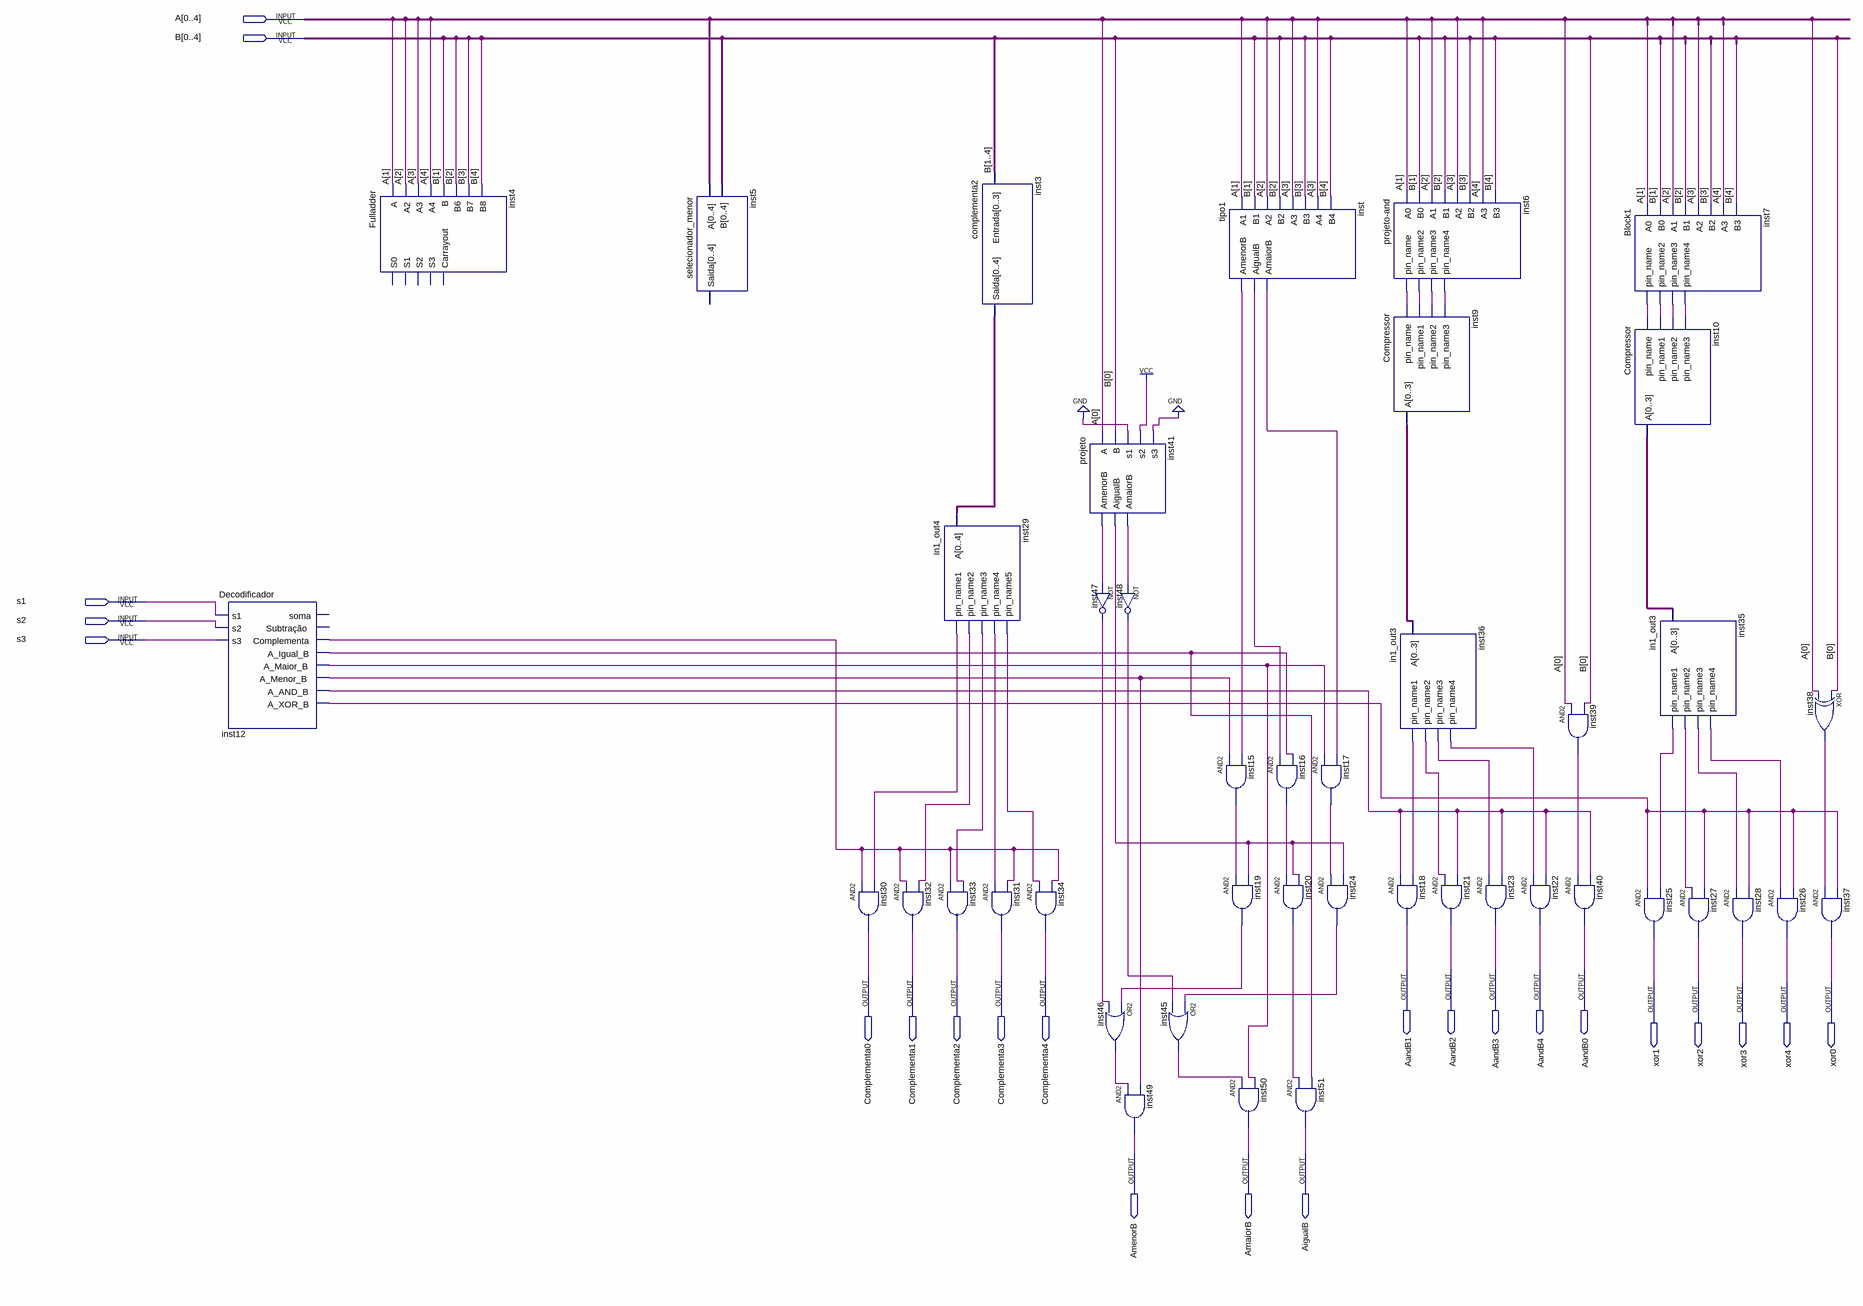
[diagram p0: schematic sheet]
// Quartus schematic Projeto_Total.bdf as structural Verilog: 43 symbols, 23 pins
module Projeto_Total (
  input  [0:4] A,
  input  [0:4] B,
  input  s1,
  input  s2,
  input  s3,
  output AandB1,
  output AandB2,
  output AandB3,
  output AandB4,
  output AandB0,
  output Complementa0,
  output Complementa1,
  output Complementa2,
  output Complementa3,
  output Complementa4,
  output xor1,
  output xor2,
  output xor3,
  output xor4,
  output xor0,
  output AmenorB,
  output AmaiorB,
  output AigualB
);

  wire inst6_pin_name, inst6_pin_name2, inst6_pin_name3, inst6_pin_name4, inst7_pin_name, inst7_pin_name2,
       inst7_pin_name3, inst7_pin_name4, inst12_a_and_b, inst12_a_igual_b, inst12_a_maior_b,
       inst12_a_menor_b, inst12_a_xor_b, inst12_complementa, inst15_out, inst16_out, inst17_out, inst19_out,
       inst20_out, inst24_out, inst29_pin_name1, inst29_pin_name2, inst29_pin_name3, inst29_pin_name4,
       inst29_pin_name5, inst35_pin_name1, inst35_pin_name2, inst35_pin_name3, inst35_pin_name4,
       inst36_pin_name1, inst36_pin_name2, inst36_pin_name3, inst36_pin_name4, inst38_out, inst39_out,
       inst41_aigualb, inst41_amaiorb, inst41_amenorb, inst45_out, inst46_out, inst47_out, inst48_out,
       inst_aigualb, inst_amaiorb, inst_amenorb;
  wire [3:0] inst9_a, inst10_a;
  wire [4:0] inst3_saida;

  Decodificador inst12 (
    .s1(s1), .s2(s2), .s3(s3), .Complementa(inst12_complementa), .A_Igual_B(inst12_a_igual_b),
    .A_Maior_B(inst12_a_maior_b), .A_Menor_B(inst12_a_menor_b), .A_AND_B(inst12_a_and_b),
    .A_XOR_B(inst12_a_xor_b));  // open: soma, Subtração
  Fulladder inst4 (
    .A(A[1]), .A2(A[2]), .A3(A[3]), .A4(A[4]), .B(B[1]), .B6(B[2]), .B7(B[3]), .B8(B[4]));  // open: S0, S1, S2, S3, Carrayout
  selecionador_menor inst5 (.A(A), .B(B));  // open: Saida
  and inst30 (Complementa0, inst12_complementa, inst29_pin_name1);
  in1_out4 inst29 (
    .A(inst3_saida), .pin_name1(inst29_pin_name1), .pin_name2(inst29_pin_name2),
    .pin_name3(inst29_pin_name3), .pin_name4(inst29_pin_name4), .pin_name5(inst29_pin_name5));
  and inst32 (Complementa1, inst12_complementa, inst29_pin_name2);
  and inst33 (Complementa2, inst12_complementa, inst29_pin_name3);
  complementa2 inst3 (.Entrada(B[1:4]), .Saida(inst3_saida));
  and inst31 (Complementa3, inst29_pin_name4, inst12_complementa);
  and inst34 (Complementa4, inst29_pin_name5, inst12_complementa);
  projeto inst41 (
    .A(A[0]), .B(B[0]), .s1(1'b0), .s2(1'b1), .s3(1'b0), .AmenorB(inst41_amenorb), .AigualB(inst41_aigualb),
    .AmaiorB(inst41_amaiorb));
  not inst47 (inst47_out, inst41_amenorb);
  not inst48 (inst48_out, inst41_amaiorb);
  or inst46 (inst46_out, inst19_out, inst47_out);
  and inst49 (AmenorB, inst46_out, inst12_a_menor_b);
  or inst45 (inst45_out, inst24_out, inst48_out);
  tipo1 inst (
    .A1(A[1]), .B1(B[1]), .A2(A[2]), .B2(B[2]), .A3(A[3]), .B3(B[3]), .A4(A[3]), .B4(B[4]),
    .AmenorB(inst_amenorb), .AigualB(inst_aigualb), .AmaiorB(inst_amaiorb));
  and inst15 (inst15_out, inst12_a_menor_b, inst_amenorb);
  and inst19 (inst19_out, inst15_out, inst41_aigualb);
  and inst50 (AmaiorB, inst45_out, inst12_a_maior_b);
  and inst16 (inst16_out, inst_aigualb, inst12_a_igual_b);
  and inst20 (inst20_out, inst16_out, inst41_aigualb);
  and inst51 (AigualB, inst20_out, inst12_a_igual_b);
  and inst17 (inst17_out, inst12_a_maior_b, inst_amaiorb);
  and inst24 (inst24_out, inst17_out, inst41_aigualb);
  \projeto-and  inst6 (
    .A0(A[1]), .B0(B[1]), .A1(A[2]), .B1(B[2]), .A2(A[3]), .B2(B[3]), .A3(A[4]), .B3(B[4]),
    .pin_name(inst6_pin_name), .pin_name2(inst6_pin_name2), .pin_name3(inst6_pin_name3),
    .pin_name4(inst6_pin_name4));
  Compressor inst9 (
    .pin_name(inst6_pin_name), .pin_name1(inst6_pin_name2), .pin_name2(inst6_pin_name3),
    .pin_name3(inst6_pin_name4), .A(inst9_a));
  in1_out3 inst36 (
    .A(inst9_a), .pin_name1(inst36_pin_name1), .pin_name2(inst36_pin_name2), .pin_name3(inst36_pin_name3),
    .pin_name4(inst36_pin_name4));
  and inst18 (AandB1, inst12_a_and_b, inst36_pin_name1);
  and inst21 (AandB2, inst36_pin_name2, inst12_a_and_b);
  and inst23 (AandB3, inst36_pin_name3, inst12_a_and_b);
  and inst22 (AandB4, inst36_pin_name4, inst12_a_and_b);
  and inst39 (inst39_out, A[0], B[0]);
  and inst40 (AandB0, inst39_out, inst12_a_and_b);
  Block1 inst7 (
    .A0(A[1]), .B0(B[1]), .A1(A[2]), .B1(B[2]), .A2(A[3]), .B2(B[3]), .A3(A[4]), .B3(B[4]),
    .pin_name(inst7_pin_name), .pin_name2(inst7_pin_name2), .pin_name3(inst7_pin_name3),
    .pin_name4(inst7_pin_name4));
  Compressor inst10 (
    .pin_name(inst7_pin_name), .pin_name1(inst7_pin_name2), .pin_name2(inst7_pin_name3),
    .pin_name3(inst7_pin_name4), .A(inst10_a));
  in1_out3 inst35 (
    .A(inst10_a), .pin_name1(inst35_pin_name1), .pin_name2(inst35_pin_name2), .pin_name3(inst35_pin_name3),
    .pin_name4(inst35_pin_name4));
  and inst25 (xor1, inst12_a_xor_b, inst35_pin_name1);
  and inst27 (xor2, inst35_pin_name2, inst12_a_xor_b);
  and inst28 (xor3, inst35_pin_name3, inst12_a_xor_b);
  and inst26 (xor4, inst35_pin_name4, inst12_a_xor_b);
  xor inst38 (inst38_out, B[0], A[0]);
  and inst37 (xor0, inst38_out, inst12_a_xor_b);
endmodule
